# Altium project electrionic_system.PrjPcb
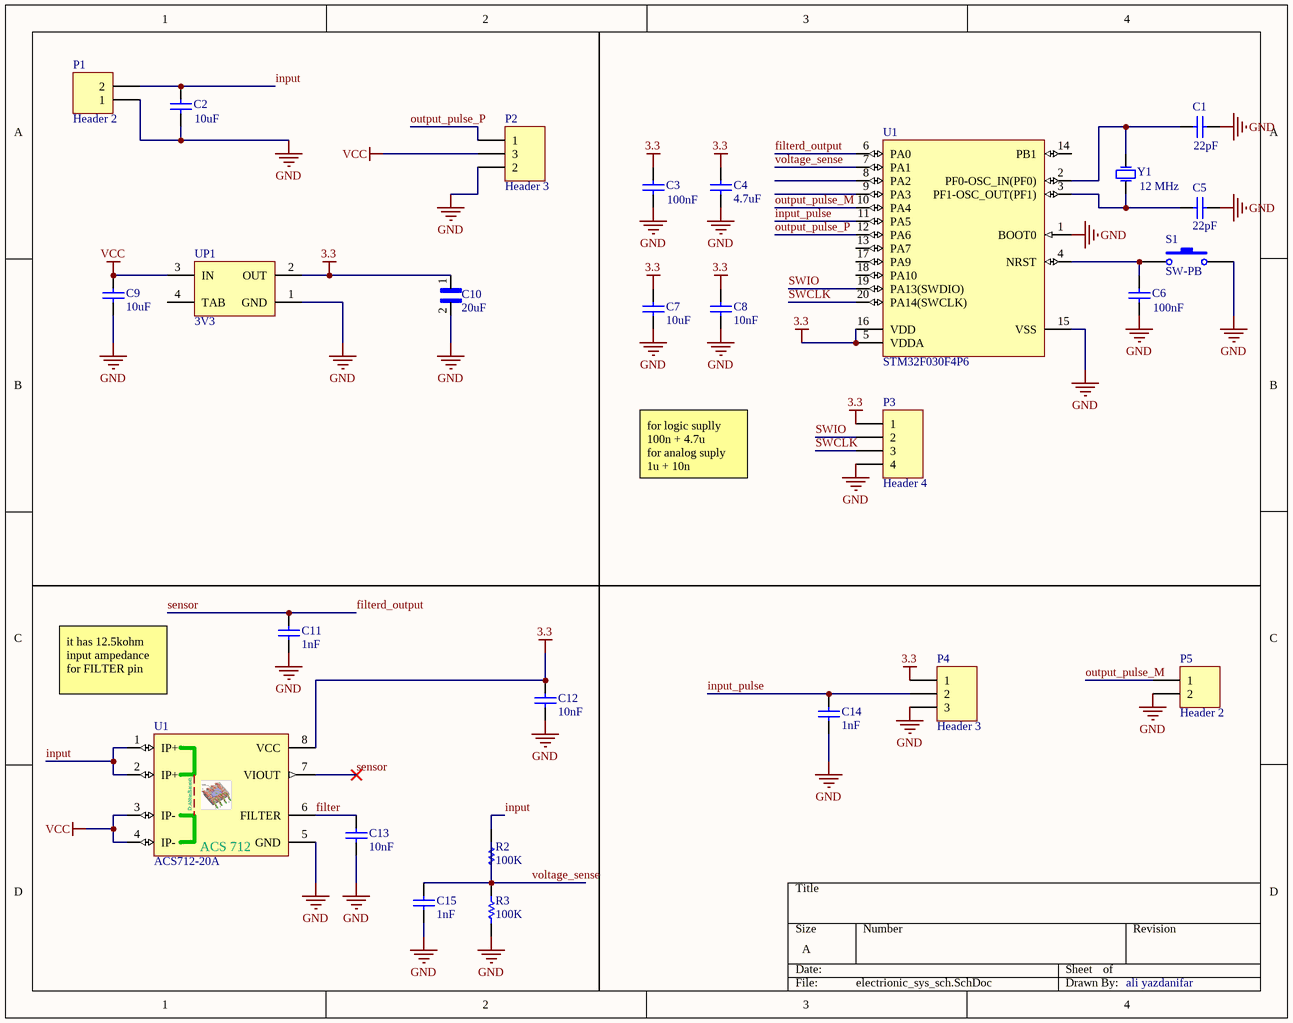
[diagram p0: electrionic_sys_sch.SchDoc]
1 sheet, 27 parts. Net scope: global (net labels, ports and power ports of the same name join across sheets).
Board file: electrionic_sys_pcb.PcbDoc

## Sheet electrionic_sys_sch.SchDoc
size A; SheetNumber: 1; SheetTotal: 1

### Parts
(Parts that share a designator on the sheet are numbered #1, #2 ... from top to bottom, then left to right.)
C1  22pF  [CAPC4817X12N]
C2  10uF  [CAPC4817X12N]
C3  100nF  [CAPC4817X12N]
C4  4.7uF  [CAPC4817X12N]
C5  22pF  [CAPC4817X12N]
C6  100nF  [CAPC4817X12N]
C7  10uF  [CAPC4817X12N]
C8  10nF  [CAPC4817X12N]
C9  10uF  [CAPC4817X12N]
C10  20uF  [CAPPC3528X210N]
C11  1nF  [CAPC4817X12N]
C12  10nF  [CAPC4817X12N]
C13  10nF  [CAPC4817X12N]
C14  1nF  [CAPC4817X12N]
C15  1nF  [CAPC4817X12N]
P1  Header 2  [HDR1X2]
P2  Header 3  [HDR1X3]
P3  Header 4  [HDR1X4]
P4  Header 3  [HDR1X3]
P5  Header 2  [HDR1X2]
R2  100K  [RESC4817X04N]
R3  100K  [RESC4817X04N]
S1  SW-PB  [SPST-2]
U1#1  STM32F030F4P6  [STM-TSSOP20_N]
U1#2  ACS712-20A  [8S2_N]
UP1  3V3  [SOT223]
Y1  12 MHz  [XTAL 16MHZ]

### Nets
3.3: C3.2 C4.2 C7.2 C8.2 C10.1 C12.2 P3.1 P4.1 U1#1.5(VDDA) U1#1.16(VDD) U1#2.8(VCC) UP1.2(OUT)
GND: C1.1 C2.1 C3.1 C4.1 C5.1 C6.1 C7.1 C8.1 C9.1 C10.2 C11.1 C12.1 C13.1 C14.1 C15.1 P1.1 P2.2 P3.4 P4.3 P5.2 R3.1 S1.2 U1#1.1(BOOT0) U1#1.15(VSS) U1#2.5(GND) UP1.1(GND)
VCC: C9.2 P2.3 U1#2.3(IP-) U1#2.4(IP-) UP1.3(IN)
filter: C13.2 U1#2.6(FILTER)
filterd_output: C11.2 U1#1.6(PA0) U1#2.7(VIOUT)  [also labelled sensor]
input: C2.2 P1.2 R2.2 U1#2.1(IP+) U1#2.2(IP+)
input_pulse: C14.2 P4.2 U1#1.11(PA5)
output_pulse_M: P5.1 U1#1.10(PA4)
output_pulse_P: P2.1 U1#1.12(PA6)
SWCLK: P3.3 U1#1.20(PA14(SWCLK))
SWIO: P3.2 U1#1.19(PA13(SWDIO))
voltage_sense: C15.2 R2.1 R3.2 U1#1.7(PA1)
NetC1_2: C1.2 U1#1.2(PF0-OSC_IN(PF0)) Y1.2(OSC2)
NetC5_2: C5.2 U1#1.3(PF1-OSC_OUT(PF1)) Y1.1(OSC1)
NetC6_2: C6.2 S1.1 U1#1.4(NRST)

Not connected (* = marked no-connect by the designer): U1#1 8(PA2) 9(PA3) 13(PA7) 14(PB1) 17(PA9) 18(PA10); UP1 4(TAB)

### Notes on the sheet
- for logic suplly
  100n + 4.7u
  for analog suply
  1u + 10n
- it has 12.5kohm
  input ampedance
  for FILTER pin
- ali yazdanifar
- (in symbol ACS712ELCTR-20A-T) D:AbbasBasereh; ACS 712

### Library data of the parts
C1-C9 C11-C15 = CAP SMD 1206: CAP 1206; Designer: Abbas Basereh; Desc.: CAP SMD 1206; Data: 16-12-2016
C10 = TAJB226M006RNJ: 22ÂµF Molded Tantalum Capacitors 6.3V 1411 _3528 Metric_, 1210; MF: AVX; Package: 1210 AVX; Price: None; Value: *; MP: TAJB226M006RNJ; SnapEDA_Link: https://www.snapeda.com/parts/TAJB226M006RNJ/AVX/view-part/1683421/?ref=snap; Availability: Unavailable
P1 P5 = Header 2: Header, 2-Pin; LatestRevisionDate: 17-Jul-2002; LatestRevisionNote: Re-released for DXP Platform.; Publisher: Altium Limited
P2 = Header 3: Header, 3-Pin; System: Connector; LatestRevisionDate: 17-Jul-2002; LatestRevisionNote: Re-released for DXP Platform.; Publisher: Altium Limited
P3 = Header 4: Header, 4-Pin; LatestRevisionDate: 17-Jul-2002; LatestRevisionNote: Re-released for DXP Platform.; Publisher: Altium Limited
P4 = Header 3: Header, 3-Pin; LatestRevisionDate: 17-Jul-2002; LatestRevisionNote: Re-released for DXP Platform.; Publisher: Altium Limited
R2 R3 = RES 1206 0.25W: RES 1206; Designer: Abbas Basereh; Desc.: RES SMD 1206; Data: 16-12-2016
S1 = SW-PB: Switch; Published: 24-Mar-1999; LatestRevisionDate: 17-Jul-2002; LatestRevisionNote: Re-released for DXP Platform.; PackageReference: SPST-2; Publisher: Altium Limited; PackageDescription: Switch; 2 Leads
U1#1 = STM32F030F4P6: ARM Cortex-M0 32-bit MCU, 16 KB Flash, 4 KB Internal RAM, 15 I/Os, 20-pin TSSOP, -40 to 85 degC, Tube; FLASH Size (Prog) (kB): 16; I/Os (High Current): 15; Internal RAM Size (kB): 4; Operating Frequency(F) (Processor speed) (MHz): 48; Supply Voltage(Vcc) min (V): 2.4; DatasheetVersion: Rev. 1; PackageVersion: Rev. 1, 11/2012; PackageReference: TSSOP20; PackageDescription: 20-Pin Thin Shrink Small Outline Package, 6.5 x 4.4 mm Body, 0.65 mm Pitch; Supplier 1: Digi-Key; Supplier Part Number 1: 497-14044-5-ND; Supplier 2: Newark; Supplier Part Number 2: 06X3648; Supplier 3: Mouser; Supplier Part Number 3: 511-STM32F030F4P6; Core: ARM Cortex-M0; Packing: Tube; Mounting Technology: Surface Mount; PartNumber: STM32F030F4P6; ComponentLink1Description: Manufacturer URL; ComponentLink1URL: http://www.st.com/web/en/home.html; ComponentLink2Description: Datasheet; ComponentLink2URL: http://www.st.com/st-web-ui/static/active/en/resource/technical/document/datasheet/DM00088500.pdf; ComponentLink3Description: Package Specification; ComponentLink3URL: http://www.st.com/st-web-ui/static/active/en/resource/technical/document/datasheet/DM00065136.pdf
U1#2 = ACS712ELCTR-20A-T: Fully Integrated, Hall Effect-Based Linear Current Sensor IC  with 2.1 kVRMS Isolation and a Low-Resistance Current Conductor; ComponentAvailability: Not recommended for new design.; Published: 2017-1-15; DatasheetVersion: Copyright ©2006-2013, Allegro MicroSystems, LLC; PackageVersion: revF, Apr-2008; PackageReference: 8 Lead SOIC; Publisher: Abbas Basereh; PackageDescription: 8-Lead, 0.208" Body, Plastic Small Outline Package (EIAJ); Supplier 1: Digi-Key; Supplier Part Number 1: ACS712ELCTR-20A-T; Supplier 2: Farnell; Supplier 3: Mouser; ComponentLink4Description: http://www.allegromicro.com/; ComponentLink4URL: http://www.allegromicro.com/
UP1 = AMS1117-x.x: x.x Volt, 800mA Low-Dropout Linear Regulator, 4-pin SOT-223; Designer: Ali Hafizi; Data: 16-12-2016
Y1 = XTAL: XTAL Crystal; Designer: ABBAS BASEREH; Design Date: 2017-1-3; ComponentLink1Description: Datasheet; ComponentLink2Description: Reference; Mounting Technology: Surface Mount\Through-Hole; Value: 12 MHz; Status: Unreleased